# EAGLE design relaysch (EAGLE 9.5.0)
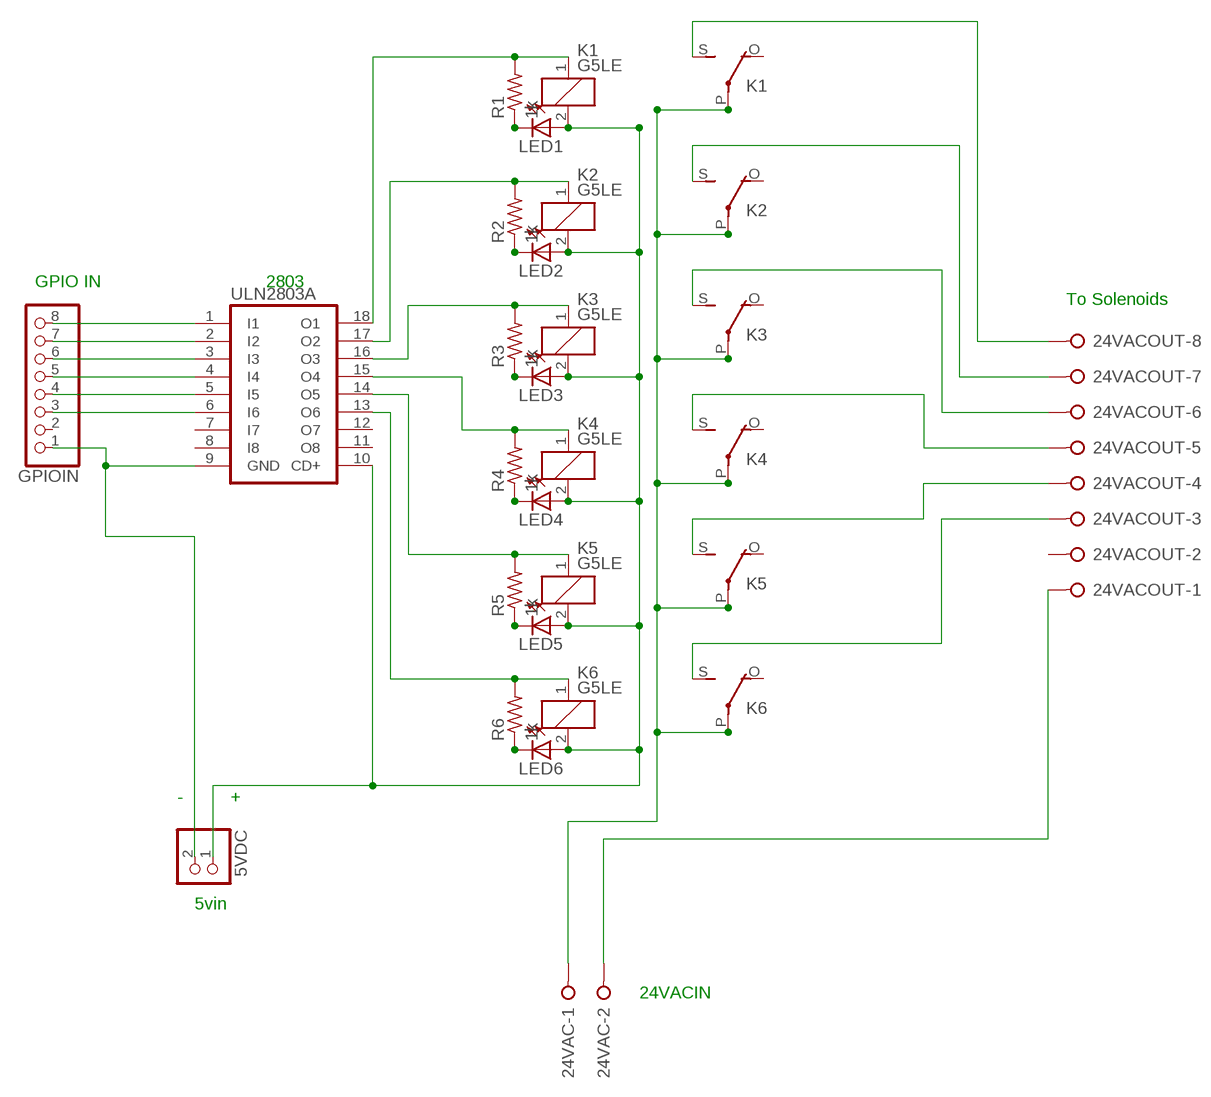
[diagram p0: schematic, sheet 1]

## Parts
5VDC  PINHD-1X2  [1X02]
24VAC  W237-02P  [W237-132]
24VACOUT  W237-08P  [W237-8P]
GPIOIN  PINHD-1X8BIG  [1X08-BIG]
K1  G5LE  [G5LE]
K2  G5LE  [G5LE]
K3  G5LE  [G5LE]
K4  G5LE  [G5LE]
K5  G5LE  [G5LE]
K6  G5LE  [G5LE]
LED1  LED5MM  [LED5MM]
LED2  LED5MM  [LED5MM]
LED3  LED5MM  [LED5MM]
LED4  LED5MM  [LED5MM]
LED5  LED5MM  [LED5MM]
LED6  LED5MM  [LED5MM]
R1  1k  FLIPFLOP-RES  [0805-THM]
R2  1k  FLIPFLOP-RES  [0805-THM]
R3  1k  FLIPFLOP-RES  [0805-THM]
R4  1k  FLIPFLOP-RES  [0805-THM]
R5  1k  FLIPFLOP-RES  [0805-THM]
R6  1k  FLIPFLOP-RES  [0805-THM]
ULN2803A  ULN2803A  [DIL18]

## Nets
5VIN: 5VDC.1 K1.2 K2.2 K3.2 K4.2 K5.2 K6.2 LED1.A LED2.A LED3.A LED4.A LED5.A LED6.A ULN2803A.10(CD+)
N$1: 24VACOUT.8 K1.S(2:S)
N$2: 24VACOUT.7 K2.S(2:S)
N$3: 24VACOUT.6 K3.S(2:S)
N$4: 24VACOUT.5 K4.S(2:S)
N$5: 24VACOUT.4 K5.S(2:S)
N$6: 24VACOUT.3 K6.S(2:S)
N$7: 24VAC.1 K1.P(2:P) K2.P(2:P) K3.P(2:P) K4.P(2:P) K5.P(2:P) K6.P(2:P)
N$8: K1.1 R1.2 ULN2803A.18(O1)
N$9: LED6.K(C) R6.1
N$10: 24VAC.2 24VACOUT.1
N$11: K3.1 R3.2 ULN2803A.16(O3)
N$12: K4.1 R4.2 ULN2803A.15(O4)
N$13: K5.1 R5.2 ULN2803A.14(O5)
N$14: K6.1 R6.2 ULN2803A.13(O6)
N$15: LED1.K(C) R1.1
N$16: LED2.K(C) R2.1
N$17: LED3.K(C) R3.1
N$18: LED5.K(C) R5.1
N$19: LED4.K(C) R4.1
N$20: K2.1 R2.2 ULN2803A.17(O2)
N$21: 5VDC.2 GPIOIN.1 ULN2803A.9(GND)
N$22: GPIOIN.8 ULN2803A.1(I1)
N$23: GPIOIN.7 ULN2803A.2(I2)
N$24: GPIOIN.6 ULN2803A.3(I3)
N$25: GPIOIN.5 ULN2803A.4(I4)
N$26: GPIOIN.4 ULN2803A.5(I5)
N$27: GPIOIN.3 ULN2803A.6(I6)
Unconnected: 24VACOUT.2 GPIOIN.2 K1.O(2:O) K2.O(2:O) K3.O(2:O) K4.O(2:O) K5.O(2:O) K6.O(2:O) ULN2803A.7(I7) ULN2803A.8(I8) ULN2803A.11(O8) ULN2803A.12(O7)

## Notes on the sheet
- GPIO IN | 2803
- To Solenoids
- - | +
- 5vin
- 24VACIN

## Library data of the parts
5VDC = pinhead:PINHD-1X2: PIN HEADER
24VAC = con-wago-508:W237-02P: WAGO SREW CLAMP; OC_FARNELL: unknown; OC_NEWARK: unknown
24VACOUT = con-wago-508:W237-08P: WAGO SREW CLAMP; OC_FARNELL: unknown; OC_NEWARK: unknown
GPIOIN = adafruit:PINHD-1X8: PIN HEADER
K1-K6 = relay:G5LE: RELAY 1 x switch, 10 A/120 V AC, 8 A/30 V DC, Omron; OC_FARNELL: unknown; OC_NEWARK: unknown
LED1-LED6 = adafruit:LED: LED OSRAM: - CHIPLED LG R971, LG N971, LY N971, LG Q971, LY Q971, LO R971, LY R971 LH N974, LH R974 LS Q976, LO Q976, LY Q976 LO Q996 - Hyper CHIPLED LW Q18S LB Q993, LB Q99A, LB R99A - SideLED LS A670, LO A670, LY A670, LG A670, LP A670 LB A673, LV A673, LT A673, LW A673 LH A674 LY A675 LS A676, LA A676, LO A676, LY A676, LW A676 LS A679, LY A679, LG A679 - Hyper Micro SIDELED® LS Y876, LA Y876, LO Y876, LY Y876 LT Y87S - SmartLED LW L88C, LW L88S LB L89C, LB L89S, LG L890 LS L89K, LO L89K, LY L89K LS L896, LA L896, LO L896, LY L896 - TOPLED LS T670, LO T670, LY T670, LG T670, LP T670 LSG T670, LSP T670, LSY T670, LOP T670, LYG T670 LG T671, LOG T671, LSG T671 LB T673, LV T673, LT T673, LW T673 LH T674 LS T676, LA T676, LO T676, LY T676, LB T676, LH T676, LSB T676, LW T676 LB T67C, LV T67C, LT T67C, LS T67K, LO T67K, LY T67K, LW E67C LS E67B, LA E67B, LO E67B, LY E67B, LB E67C, LV E67C, LT E67C LW T67C LS T679, LY T679, LG T679 LS T770, LO T770, LY T770, LG T770, LP T770 LB T773, LV T773, LT T773, LW T773 LH T774 LS E675, LA E675, LY E675, LS T675 LS T776, LA T776, LO T776, LY T776, LB T776 LHGB T686 LT T68C, LB T68C - Hyper Mini TOPLED® LB M676 - Mini TOPLED Santana® LG M470 LS M47K, LO M47K, LY M47K Source: http://www.osram.convergy.de/
R1-R6 = adafruit:FLIPFLOP-RES: Flip Flop resistor An 0805 resistor inside a standard 1/4W 5% resistor. Makes for easy mods
ULN2803A = uln-udn:ULN2803A: DRIVER ARRAY

## Board
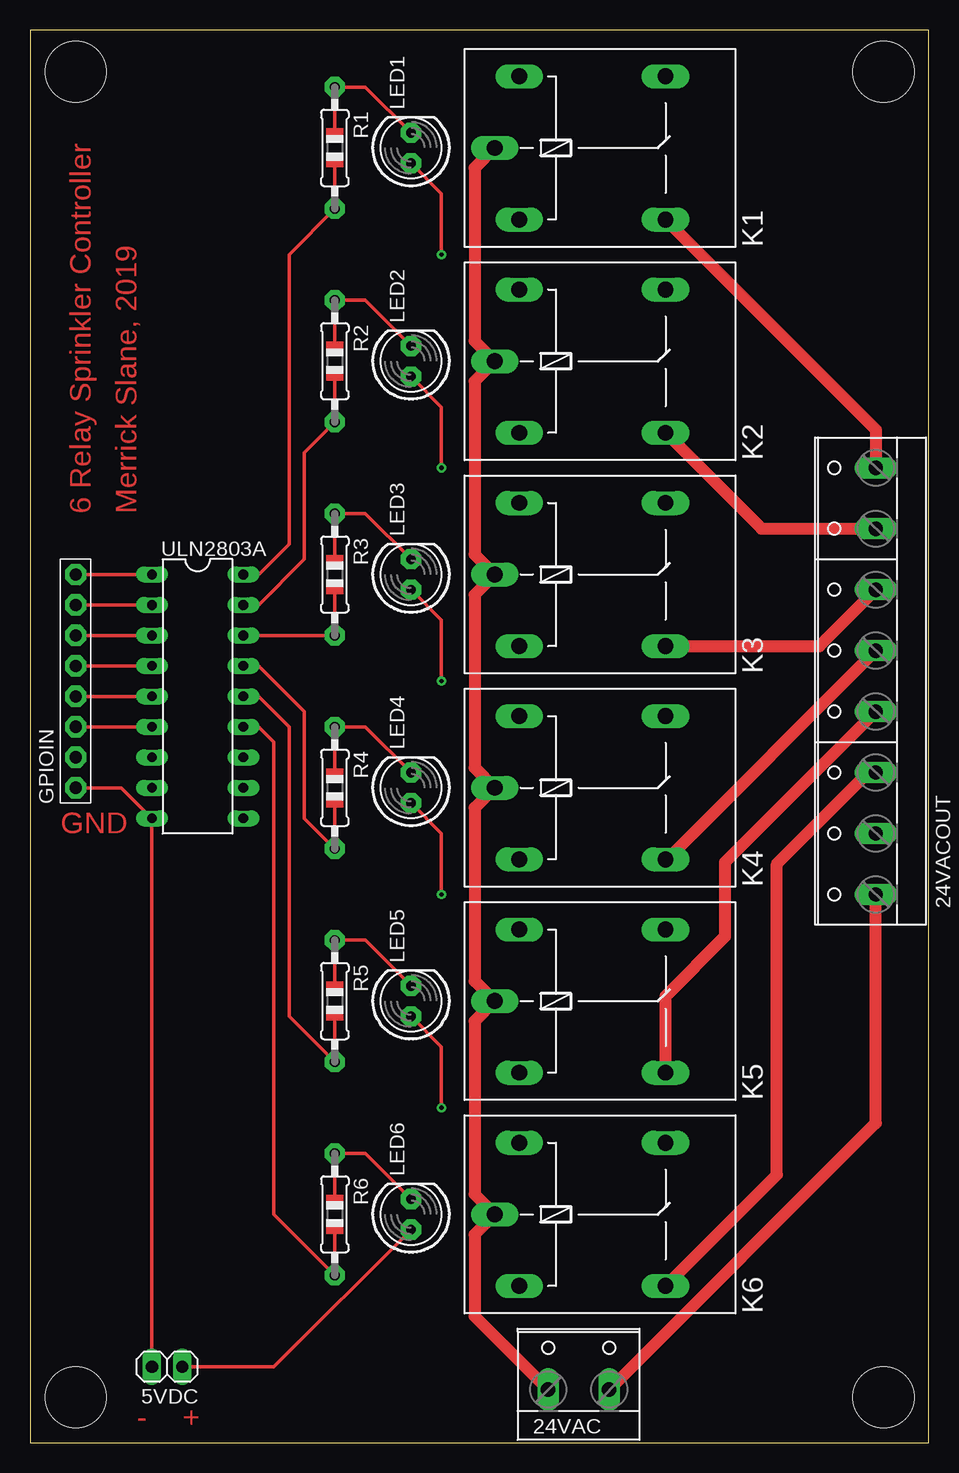
[diagram p1: board, top side]
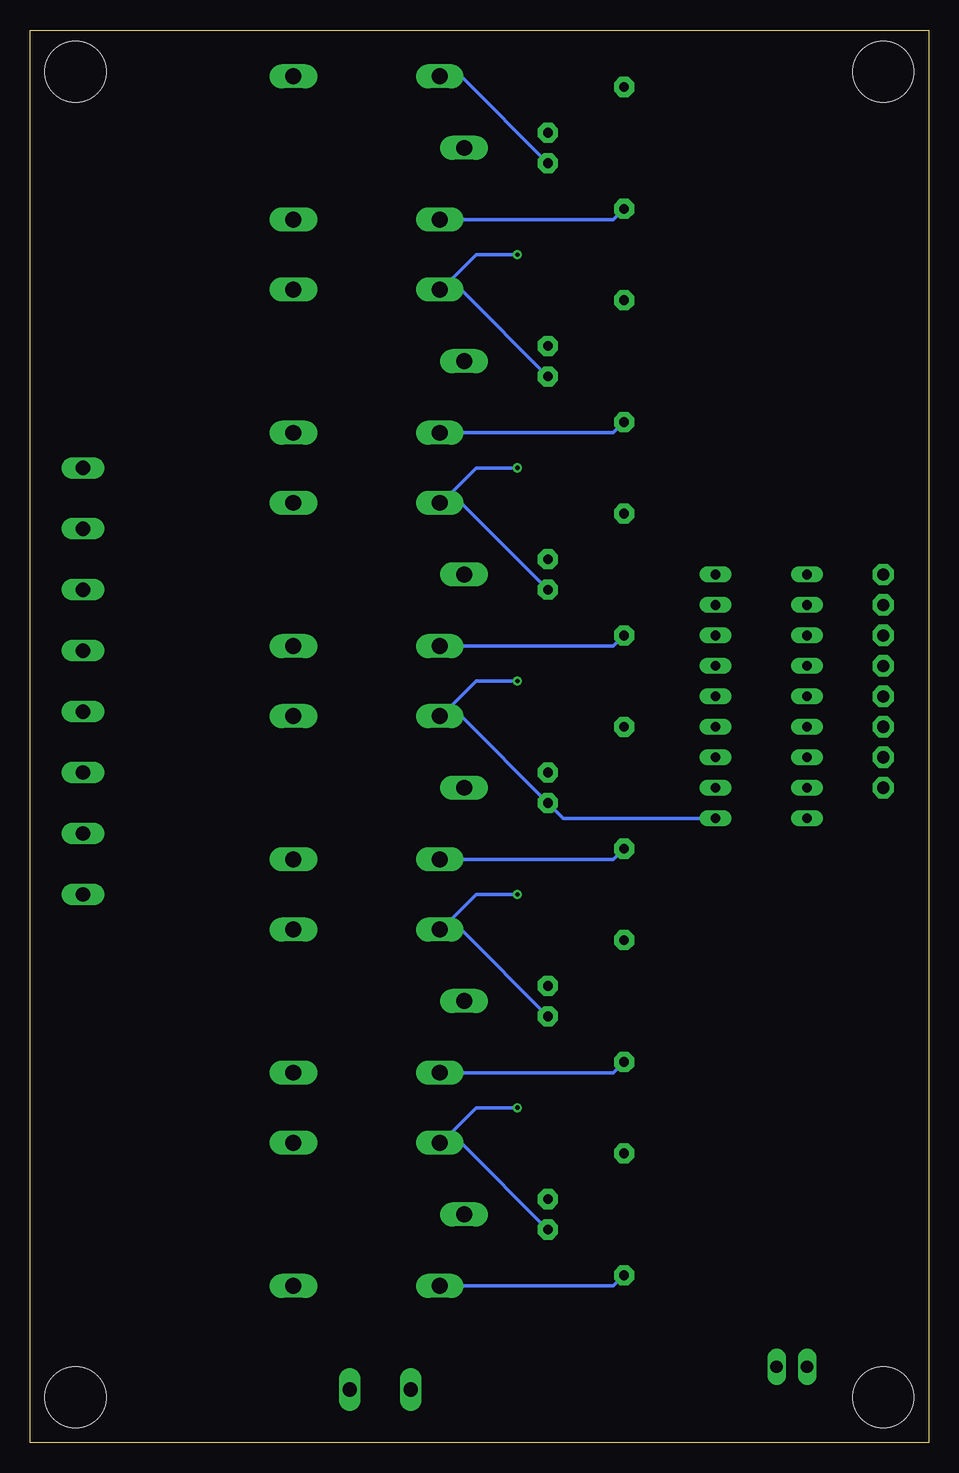
[diagram p2: board, bottom side, seen from below]

Size 74.91 x 117.78 mm. Coordinates in mm from the lower left corner, seen from the top.
Outline: 0,0 74.91,0 74.91,117.78 0,117.78 0,0
Copper layers (1*16): Top 0.035mm / dielectric 1.5mm / Bottom 0.035mm
Design rules "default": minimum track width 6mil, minimum drill 0.35mm, track to track 6mil, track to pad 6mil, pad to pad 6mil, via to via 6mil, smd to smd 6mil, copper to edge 40mil, drill to drill 6mil, minimum pad ring 10mil, minimum via ring 8mil, stop-mask expansion 4mil, vias tented up to drill 0mil, thermal gap 10mil
Holes 5.08 mm at 3.81,114.3 71.12,114.3 3.81,3.81 71.12,3.81

### Footprints (pad centres in the part's own frame; a part is rotated, then mirrored left to right if it is on the bottom)
1X02 = drill 1.016 long: 1 -1.27,0; 2 1.27,0
W237-132 = drill 1.194 long: 1 -2.54,-0.635; 2 2.54,-0.635
W237-8P = drill 1.194 long: 1 -17.78,-0.635; 2 -12.7,-0.635; 3 -7.62,-0.635; 4 -2.54,-0.635; 5 2.54,-0.635; 6 7.62,-0.635; 7 12.7,-0.635; 8 17.78,-0.635
1X08-BIG = drill 1.016 pad 1.778 octagon: 1 -8.89,0; 2 -6.35,0; 3 -3.81,0; 4 -1.27,0; 5 1.27,0; 6 3.81,0; 7 6.35,0; 8 8.89,0
G5LE = drill 1.321 long: 1 -7.493,-5.969; 2 -7.493,5.969; O 4.699,5.969; P -9.525,0; S 4.699,-5.969
LED5MM = drill 0.813 pad 1.676 octagon: A -1.27,0; K 1.27,0
0805-THM = drill 0.813 pad 1.676 octagon: 1 -5.08,0; 2 5.08,0
DIL18 = drill 0.813 long: 1 -10.16,-3.81; 2 -7.62,-3.81; 3 -5.08,-3.81; 4 -2.54,-3.81; 5 0,-3.81; 6 2.54,-3.81; 7 5.08,-3.81; 8 7.62,-3.81; 9 10.16,-3.81; 10 10.16,3.81; 11 7.62,3.81; 12 5.08,3.81; 13 2.54,3.81; 14 0,3.81; 15 -2.54,3.81; 16 -5.08,3.81; 17 -7.62,3.81; 18 -10.16,3.81

### Placement (x,y rotation side)
5VDC  11.43,6.35 180 top
24VAC  45.72,5.08 0 top
24VACOUT  69.85,63.5 90 top
GPIOIN  3.81,63.5 90 top
K1  48.26,107.95 0 top
K2  48.26,90.17 0 top
K3  48.26,72.39 0 top
K4  48.26,54.61 0 top
K5  48.26,36.83 0 top
K6  48.26,19.05 0 top
LED1  31.75,107.95 90 top
LED2  31.75,90.17 90 top
LED3  31.75,72.39 90 top
LED4  31.75,54.61 90 top
LED5  31.75,36.83 90 top
LED6  31.75,19.05 90 top
R1  25.4,107.95 270 top
R2  25.4,90.17 270 top
R3  25.4,72.39 270 top
R4  25.4,54.61 270 top
R5  25.4,36.83 270 top
R6  25.4,19.05 270 top
ULN2803A  13.97,62.23 270 top

### Tracks (layer width: path | path; a pad name or v marks a point on that pad's centre or on a via)
5VIN  (via drill 0.35)
  Top 0.305: 5VDC.1 20.32,6.35 LED6.A | LED1.A 34.29,104.14 v34.29,99.06 | LED2.A 34.29,86.36 v34.29,81.28 | LED3.A 34.29,68.58 v34.29,63.5 | LED4.A 34.29,50.8 v34.29,45.72 | LED5.A 34.29,33.02 v34.29,27.94
  Bottom 0.305: LED1.A 38.99,113.92 K1.2 | LED2.A 38.99,96.14 40.64,96.14 | 40.64,96.14 K2.2 | LED3.A 38.99,78.36 40.64,78.36 | 40.64,78.36 K3.2 | 40.64,60.58 38.99,60.58 LED4.A 30.48,52.07 ULN2803A.10 | 40.64,60.58 K4.2 | LED5.A 38.99,42.8 40.64,42.8 | 40.64,42.8 K5.2 | LED6.A 38.99,25.02 40.64,25.02 | 40.64,25.02 K6.2 | v34.29,99.06 37.72,99.06 40.64,96.14 | v34.29,81.28 37.72,81.28 40.64,78.36 | v34.29,63.5 37.72,63.5 40.64,60.58 | v34.29,45.72 37.72,45.72 40.64,42.8 | v34.29,27.94 37.72,27.94 40.64,25.02
N$1
  Top 1.016: K1.S 70.48,84.45 24VACOUT.8
N$2
  Top 1.016: K2.S 60.96,76.2 24VACOUT.7
N$3
  Top 1.016: K3.S 65.79,66.42 24VACOUT.6
N$4
  Top 0.61: K4.S 53.09,48.64
  Top 1.016: 24VACOUT.5 53.09,48.64
N$5
  Top 1.016: K5.S 52.96,37.22 57.94,42.2 57.94,48.41 24VACOUT.4
N$6
  Top 0.61: 69.85,55.88 24VACOUT.3
  Top 1.016: K6.S 62.23,22.35 62.23,48.26 69.85,55.88
N$7
  Top 1.016: 24VAC.1 37.06,10.57 37.06,17.37 K6.P 37.06,20.73 37.06,35.15 K5.P 37.06,38.51 37.06,52.93 K4.P 37.06,56.29 37.06,70.71 K3.P 37.06,74.07 37.06,88.49 K2.P 37.06,91.85 37.06,106.27 K1.P
N$8
  Top 0.305: R1.2 21.59,99.06 21.59,74.93 19.05,72.39 ULN2803A.18
  Bottom 0.305: R1.2 26.29,101.98 K1.1
N$9
  Top 0.305: R6.1 27.94,24.13 LED6.K
N$10
  Top 1.016: 24VAC.2 70.48,26.67 24VACOUT.1
N$11
  Top 0.305: R3.2 ULN2803A.16
  Bottom 0.305: R3.2 26.29,66.42 K3.1
N$12
  Top 0.305: R4.2 22.86,52.07 22.86,60.96 19.05,64.77 ULN2803A.15
  Bottom 0.305: R4.2 26.29,48.64 K4.1
N$13
  Top 0.305: R5.2 21.59,35.56 21.59,59.69 19.05,62.23 ULN2803A.14
  Bottom 0.305: R5.2 26.29,30.86 K5.1
N$14
  Top 0.305: R6.2 20.32,19.05 20.32,58.42 19.05,59.69 ULN2803A.13
  Bottom 0.305: 25.16,13.97 R6.2 26.29,13.08 K6.1
N$15
  Top 0.305: R1.1 27.94,113.03 LED1.K
N$16
  Top 0.305: R2.1 27.94,95.25 LED2.K
N$17
  Top 0.305: R3.1 27.94,77.47 LED3.K
N$18
  Top 0.305: R5.1 27.94,41.91 LED5.K
N$19
  Top 0.305: R4.1 27.94,59.69 LED4.K
N$20
  Top 0.305: R2.2 22.86,82.55 22.86,73.66 19.05,69.85 ULN2803A.17
  Bottom 0.305: R2.2 26.29,84.2 K2.1
N$21
  Top 0.305: GPIOIN.1 7.62,54.61 ULN2803A.9 5VDC.2
N$22
  Top 0.305: GPIOIN.8 ULN2803A.1
N$23
  Top 0.305: GPIOIN.7 ULN2803A.2
N$24
  Top 0.305: GPIOIN.6 ULN2803A.3
N$25
  Top 0.305: GPIOIN.5 ULN2803A.4
N$26
  Top 0.305: GPIOIN.4 ULN2803A.5
N$27
  Top 0.305: GPIOIN.3 ULN2803A.6

### Text on the board
Top: 6 Relay Sprinkler Controller | Merrick Slane, 2019 | GND | - | +